# Altium schematic sheet MCU.SchDoc
size A4
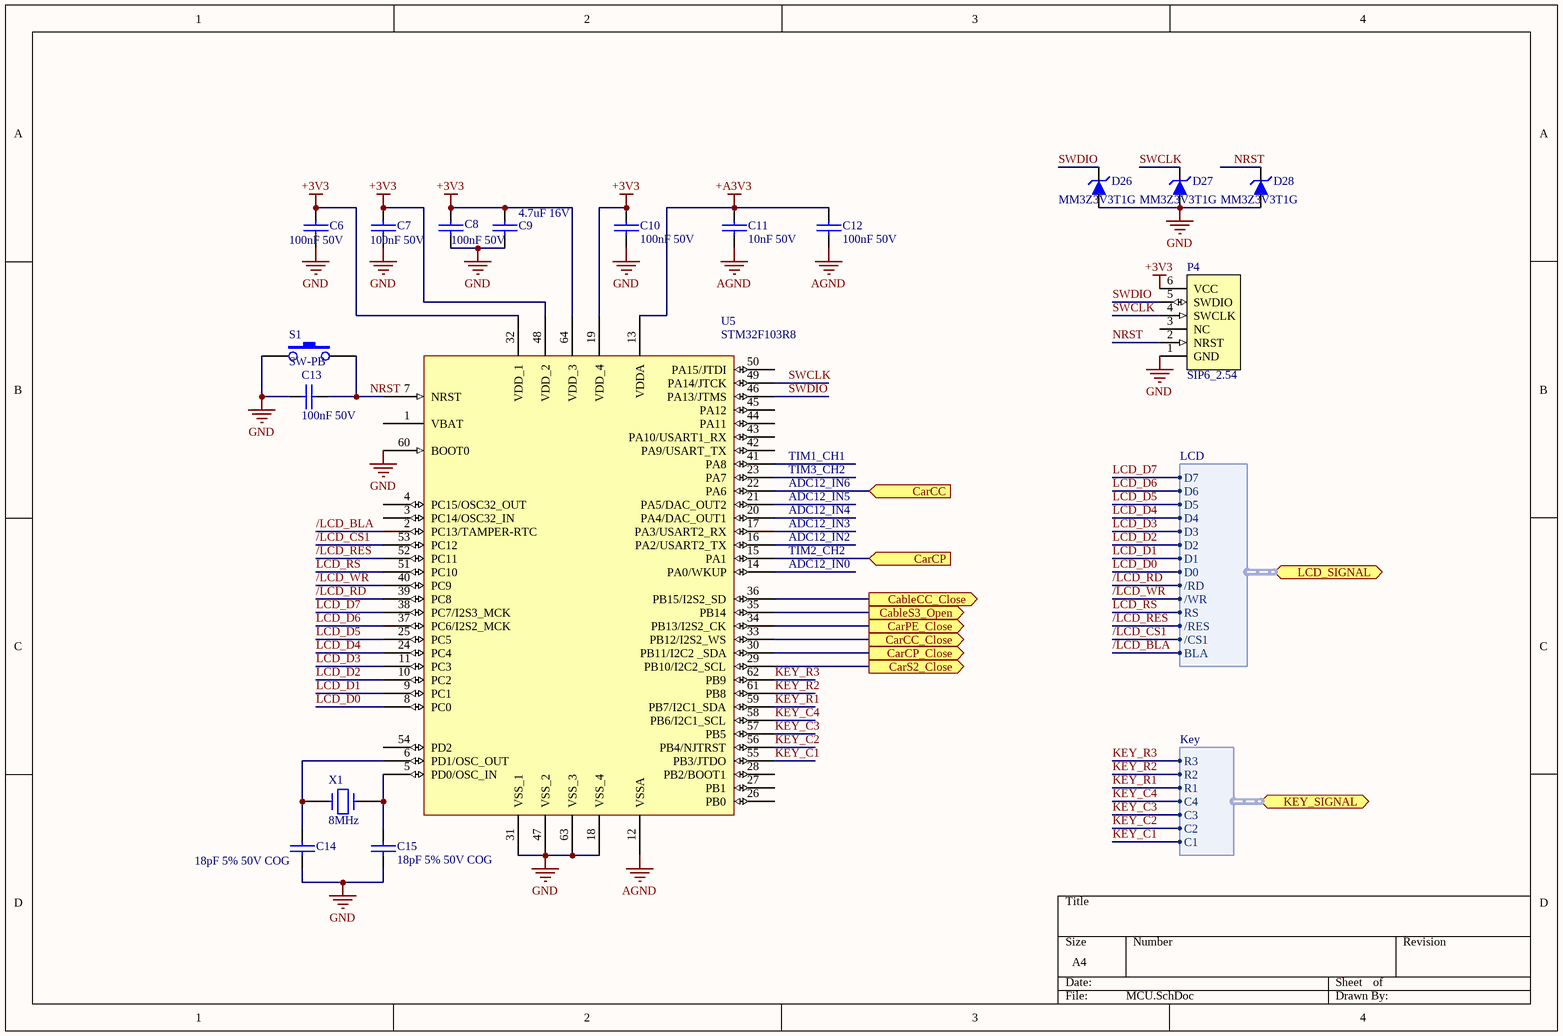
[diagram p0: MCU.SchDoc]

## Parts
C6  100nF 50V  [CAPC2012N]
C7  100nF 50V  [CAPC2012N]
C8  100nF 50V  [CAPC2012N]
C9  4.7uF 16V  [CAPC2012N]
C10  100nF 50V  [CAPC2012N]
C11  10nF 50V  [CAPC2012N]
C12  100nF 50V  [CAPC2012N]
C13  100nF 50V  [CAPC2012N]
C14  18pF 5% 50V COG  [CAPC2012N]
C15  18pF 5% 50V COG  [CAPC2012N]
D26  MM3Z3V3T1G  [SOD-323]
D27  MM3Z3V3T1G  [SOD-323]
D28  MM3Z3V3T1G  [SOD-323]
P4  SIP6_2.54  [REAL_SIP6_2.54]
S1  SW-PB  [SW5X7]  (no BOM)
U5  STM32F103R8  [TQFP64_M]
X1  8MHz  [ATSM-49]

## Ports
CableCC_Close (out), CableS3_Open (out), CarCC (in), CarCC_Close (out), CarCP (in), CarCP_Close (out), CarPE_Close (out), CarS2_Close (out), KEY_SIGNAL (harness Key), LCD_SIGNAL (harness LCD)

## Harnesses
LCD: D7, D6, D5, D4, D3, D2, D1, D0, /RD, /WR, RS, /RES, /CS1, BLA
Key: R3, R2, R1, C4, C3, C2, C1

## Nets
+3V3: C6.2 C7.1 C8.1 C9.1 C10.1 P4.6(VCC) U5.19(VDD_4) U5.32(VDD_1) U5.48(VDD_2) U5.64(VDD_3)
+A3V3: C11.1 C12.1 U5.13(VDDA)
AGND: C11.2 C12.2 U5.12(VSSA)
GND: C6.1 C7.2 C8.2 C9.2 C10.2 C13.2 C14.2 C15.1 D26.2(A) D27.2(A) D28.2(A) P4.1(GND) S1.1 U5.18(VSS_4) U5.31(VSS_1) U5.47(VSS_2) U5.60(BOOT0) U5.63(VSS_3)
/LCD_BLA: U5.2(PC13/TAMPER-RTC) ; port LCD_SIGNAL.BLA
/LCD_CS1: U5.53(PC12) ; port LCD_SIGNAL./CS1
/LCD_RD: U5.39(PC8) ; port LCD_SIGNAL./RD
/LCD_RES: U5.52(PC11) ; port LCD_SIGNAL./RES
/LCD_WR: U5.40(PC9) ; port LCD_SIGNAL./WR
CableCC_Close: U5.36(PB15/I2S2_SD) ; port CableCC_Close
CableS3_Open: U5.35(PB14) ; port CableS3_Open
CarCC: U5.22(PA6) ; port CarCC
CarCC_Close: U5.33(PB12/I2S2_WS) ; port CarCC_Close
CarCP: U5.15(PA1) ; port CarCP
CarCP_Close: U5.30(PB11/I2C2__SDA) ; port CarCP_Close
CarPE_Close: U5.34(PB13/I2S2_CK) ; port CarPE_Close
CarS2_Close: U5.29(PB10/I2C2_SCL) ; port CarS2_Close
KEY_C1: U5.55(PB3/JTDO) ; port KEY_SIGNAL.C1
KEY_C2: U5.56(PB4/NJTRST) ; port KEY_SIGNAL.C2
KEY_C3: U5.57(PB5) ; port KEY_SIGNAL.C3
KEY_C4: U5.58(PB6/I2C1_SCL) ; port KEY_SIGNAL.C4
KEY_R1: U5.59(PB7/I2C1_SDA) ; port KEY_SIGNAL.R1
KEY_R2: U5.61(PB8) ; port KEY_SIGNAL.R2
KEY_R3: U5.62(PB9) ; port KEY_SIGNAL.R3
LCD_D0: U5.8(PC0) ; port LCD_SIGNAL.D0
LCD_D1: U5.9(PC1) ; port LCD_SIGNAL.D1
LCD_D2: U5.10(PC2) ; port LCD_SIGNAL.D2
LCD_D3: U5.11(PC3) ; port LCD_SIGNAL.D3
LCD_D4: U5.24(PC4) ; port LCD_SIGNAL.D4
LCD_D5: U5.25(PC5) ; port LCD_SIGNAL.D5
LCD_D6: U5.37(PC6/I2S2_MCK) ; port LCD_SIGNAL.D6
LCD_D7: U5.38(PC7/I2S3_MCK) ; port LCD_SIGNAL.D7
LCD_RS: U5.51(PC10) ; port LCD_SIGNAL.RS
NRST: C13.1 D28.1(K) P4.2(NRST) S1.2 U5.7(NRST)
SWCLK: D27.1(K) P4.4(SWCLK) U5.49(PA14/JTCK)
SWDIO: D26.1(K) P4.5(SWDIO) U5.46(PA13/JTMS)
NetC14_1: C14.1 U5.6(PD1/OSC_OUT) X1.1
NetC15_2: C15.2 U5.5(PD0/OSC_IN) X1.2

Not connected (* = marked no-connect by the designer): P4 3(NC); U5 1(VBAT) 3(PC14/OSC32_IN) 4(PC15/OSC32_OUT) 14(PA0/WKUP) 16(PA2/USART2_TX) 17(PA3/USART2_RX) 20(PA4/DAC_OUT1) 21(PA5/DAC_OUT2) 23(PA7) 26(PB0) 27(PB1) 28(PB2/BOOT1) 41(PA8) 42(PA9/USART_TX) 43(PA10/USART1_RX) 44(PA11) 45(PA12) 50(PA15/JTDI) 54(PD2)

## Notes on the sheet
- ADC12_IN4
- ADC12_IN5
- TIM3_CH2
- TIM1_CH1
- ADC12_IN6
- ADC12_IN2
- ADC12_IN3
- ADC12_IN0
- TIM2_CH2

## Library data of the parts
C6-C15 = CAP: Capacitor
  C6-C8 C10-C15: Price: 0.025
D26-D28 = Zener Diode: Manufacturer: ON; Price: *
P4 = SWD-Connector: SW debug connector
U5 = STM32F105RX: Price: 10.3
X1 = CRYSTAL: 晶振; Price: 0.25